# Altium schematic sheet InterfMCU.SchDoc
size 420 x 297 mm; Address1: Address1; Address2: Address2; Address3: Address3; Address4: Address4; SheetNumber: 5; SheetTotal: 5; Scale: 1:1; DocumentType: Схема электрическая принципиальная
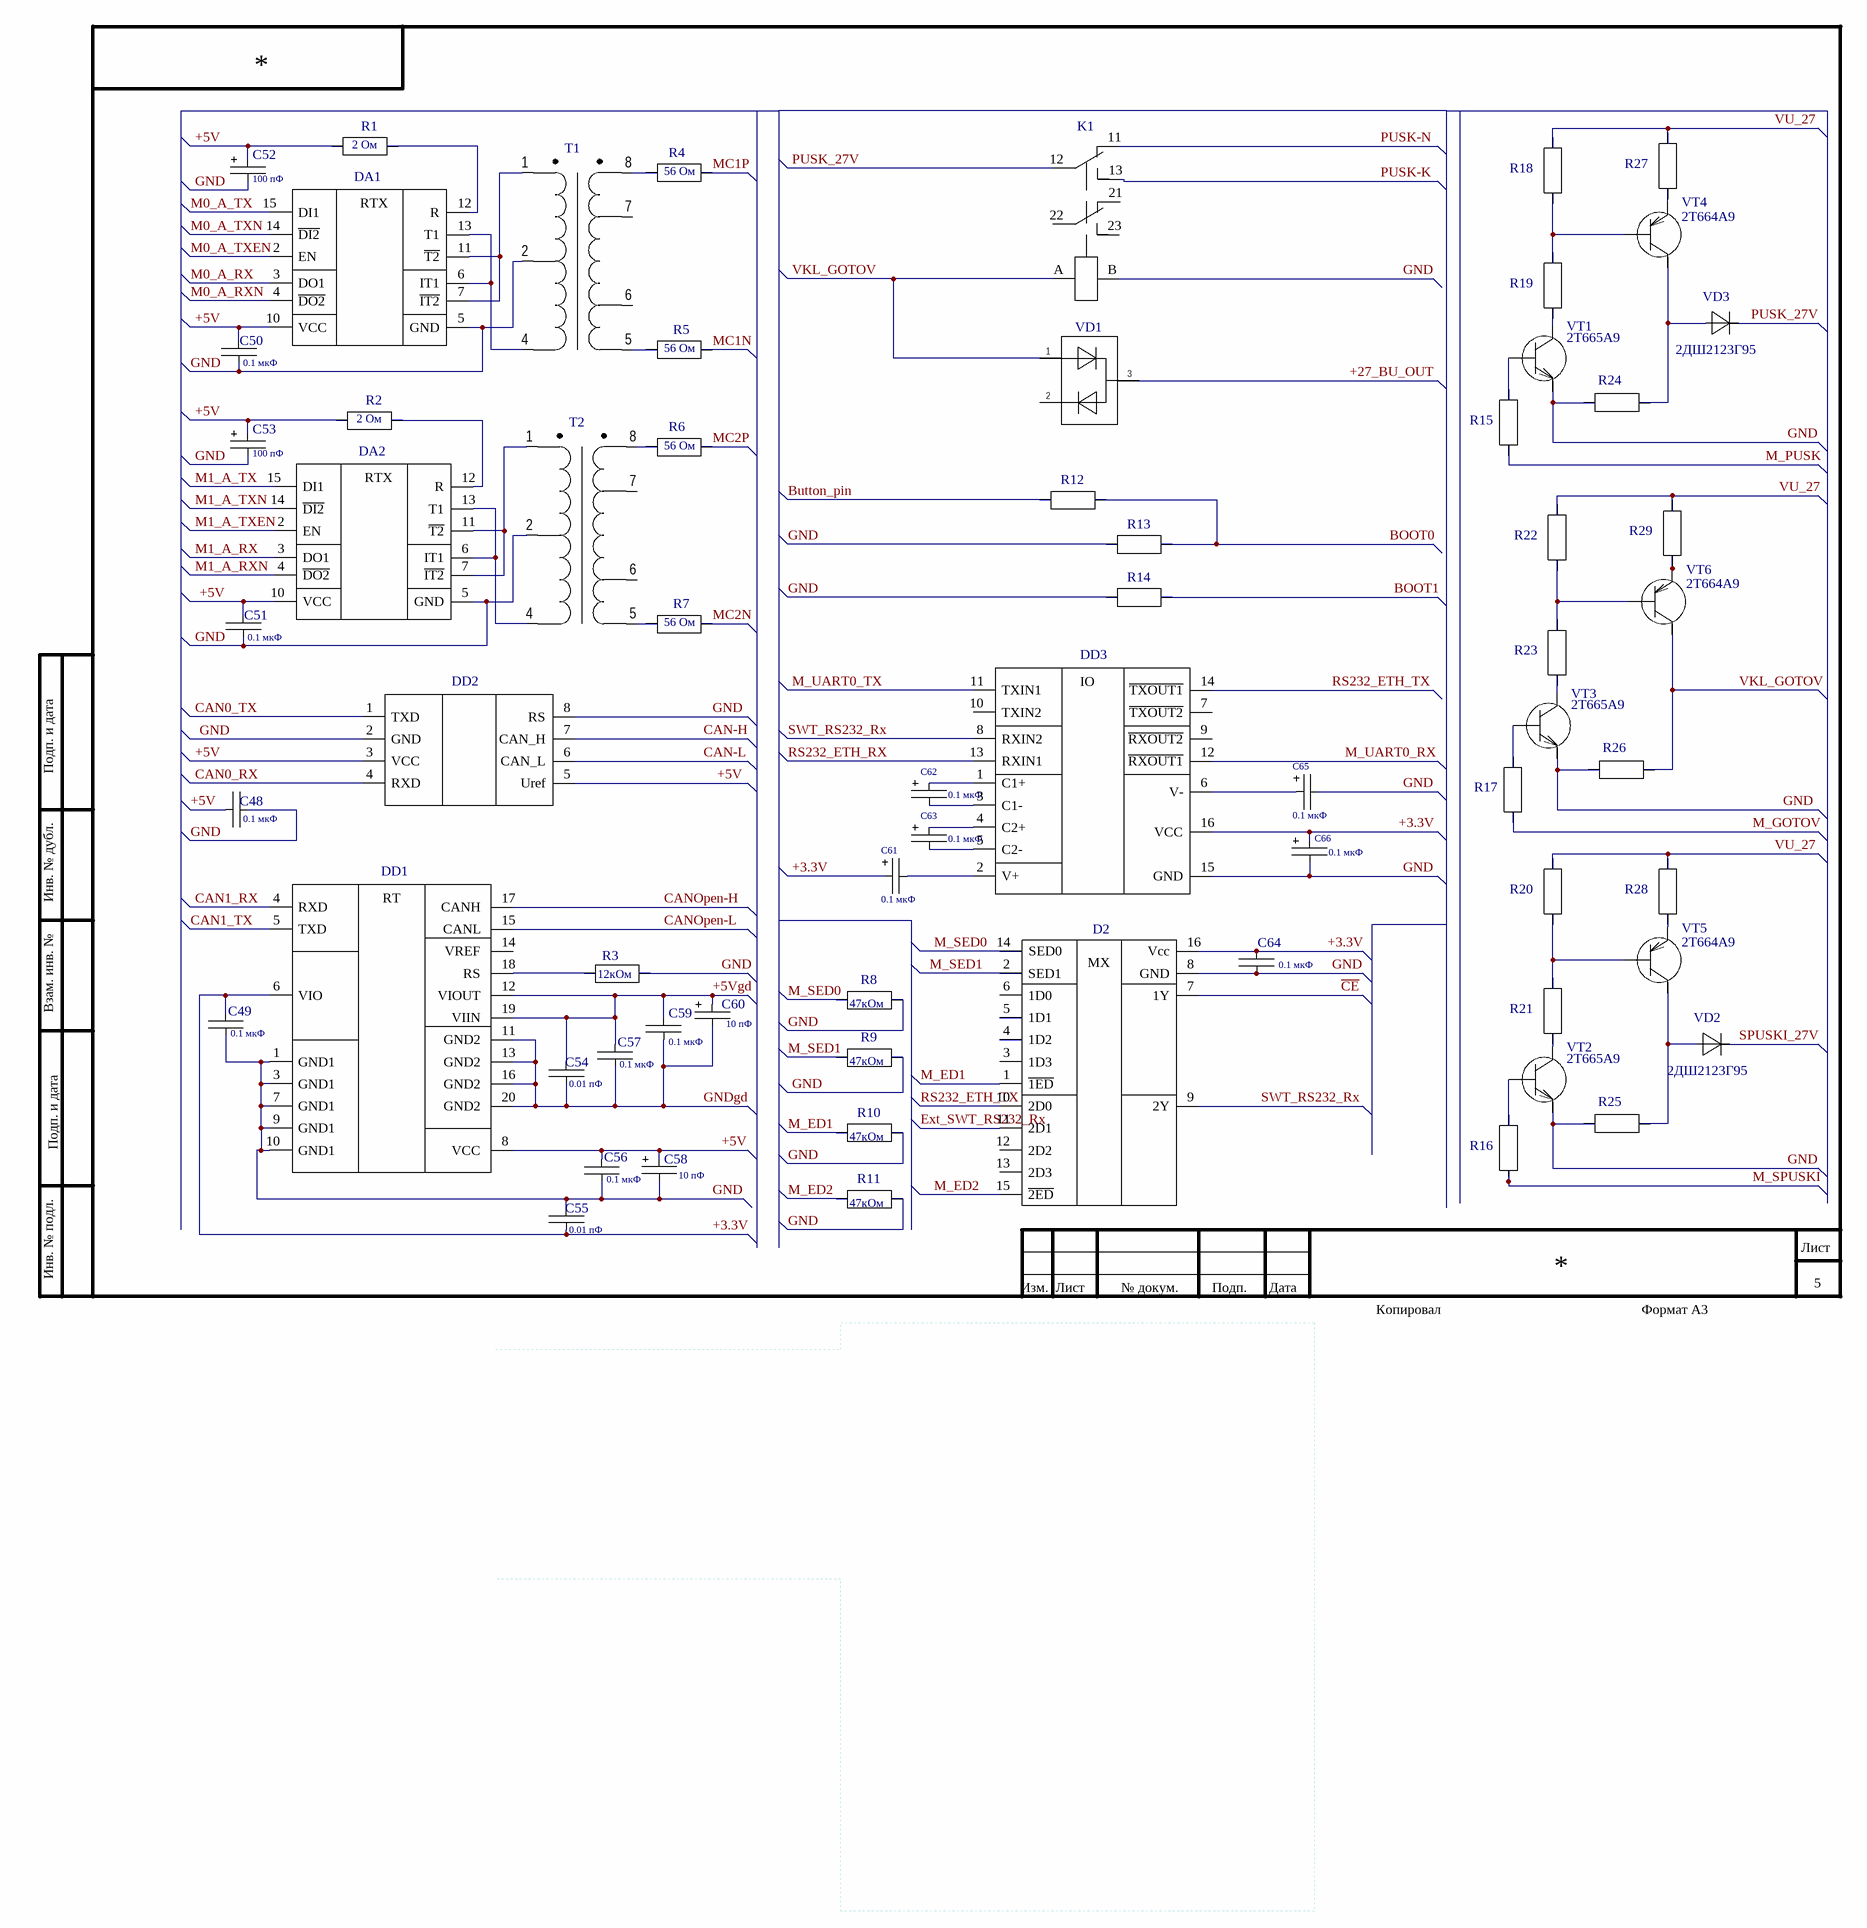
[diagram p0: InterfMCU.SchDoc]

## Parts
C48  0.1 мкФ  [C0805]
C49  0.1 мкФ  [C0805]
C50  0.1 мкФ  [C0805]
C51  0.1 мкФ  [C0805]
C52  100 пФ  [К53-68E]
C53  100 пФ  [К53-68E]
C54  0.01 пФ  [C0805]
C55  0.01 пФ  [C0805]
C56  0.1 мкФ  [C0805]
C57  0.1 мкФ  [C0805]
C58  10 пФ  [К53-67]
C59  0.1 мкФ  [C0805]
C60  10 пФ  [К53-67]
C61  0.1 мкФ  [К53-67]
C62  0.1 мкФ  [К53-67]
C63  0.1 мкФ  [К53-67]
C64  0.1 мкФ  [C0805]
C65  0.1 мкФ  [К53-67]
C66  0.1 мкФ  [К53-67]
D2  1554КП12ТБ  [1554КП12ТБ]  (value not drawn)
DA1  5559ИН13У1  [N09.28-1B]  (value not drawn)
DA2  5559ИН13У1  [N09.28-1B]  (value not drawn)
DD1  ADM3053BRWZ-REEL7_1  [SOIC-20]  (value not drawn)
DD2  ILA82C251D  [SOIC-8]  (value not drawn)
DD3  ILX3232  [SOIC-16]  (value not drawn)
K1  РЭК60  [RELE-REK61_K_RELE-REK-61(Primary)]  (value not drawn)
R1  2 Ом  [P1-12-0.5(1210)]
R2  2 Ом  [P1-12-0.5(1210)]
R3  12кОм  [P1-12-0.125(0805)]
R4  56 Ом  [P1-12-0.5(1210)]
R5  56 Ом  [P1-12-0.5(1210)]
R6  56 Ом  [P1-12-0.5(1210)]
R7  56 Ом  [P1-12-0.5(1210)]
R8  47кОм  [P1-12-0.125(0805)]
R9  47кОм  [P1-12-0.125(0805)]
R10  47кОм  [P1-12-0.125(0805)]
R11  47кОм  [P1-12-0.125(0805)]
R12  47кОм  [P1-12-0.125(0805)]  (value not drawn)
R13  47кОм  [P1-12-0.125(0805)]  (value not drawn)
R14  47кОм  [P1-12-0.125(0805)]  (value not drawn)
R15  47кОм  [P1-12-0.125(0805)]  (value not drawn)
R16  47кОм  [P1-12-0.125(0805)]  (value not drawn)
R17  47кОм  [P1-12-0.125(0805)]  (value not drawn)
R18  47кОм  [P1-12-0.125(0805)]  (value not drawn)
R19  47кОм  [P1-12-0.125(0805)]  (value not drawn)
R20  47кОм  [P1-12-0.125(0805)]  (value not drawn)
R21  47кОм  [P1-12-0.125(0805)]  (value not drawn)
R22  47кОм  [P1-12-0.125(0805)]  (value not drawn)
R23  47кОм  [P1-12-0.125(0805)]  (value not drawn)
R24  47кОм  [P1-12-0.125(0805)]  (value not drawn)
R25  47кОм  [P1-12-0.125(0805)]  (value not drawn)
R26  47кОм  [P1-12-0.125(0805)]  (value not drawn)
R27  47кОм  [P1-12-0.125(0805)]  (value not drawn)
R28  47кОм  [P1-12-0.125(0805)]  (value not drawn)
R29  47кОм  [P1-12-0.125(0805)]  (value not drawn)
VD1  2Д707АС9  [KT-46]  (value not drawn)
VD2  2ДШ2123Г95  [KT-99-1]
VD3  2ДШ2123Г95  [KT-99-1]
VT1  2T665A9  [KT-99-1]
VT2  2T665A9  [KT-99-1]
VT3  2T665A9  [KT-99-1]
VT4  2T664A9  [KT-99-1]
VT5  2T664A9  [KT-99-1]
VT6  2T664A9  [KT-99-1]
Т1  (no value)  [ТИЛ6В]
Т2  (no value)  [ТИЛ6В]

## Nets
+3.3V: C49.1 C55.2 C61.1 C64.1 C66.1 D2.16(Vcc) DD1.6(VIO) DD3.16(VCC)
+5V: C48.1 C50.1 C51.1 C52.1 C53.1 C56.1 C58.1 DA1.10(VCC) DA2.10(VCC) DD1.8(VCC) DD2.3(VCC) DD2.5(Uref) R1.1 R2.1
+5Vgd: C54.1 C57.1 C59.1 C60.1 DD1.12(VIOUT) DD1.19(VIIN)
+27_BU_OUT: VD1.3
~{CE}: D2.7(1Y)
BOOT0: R12.2 R13.2
BOOT1: R14.2
Button_pin: R12.1
CAN0_RX: DD2.4(RXD)
CAN0_TX: DD2.1(TXD)
CAN1_RX: DD1.4(RXD)
CAN1_TX: DD1.5(TXD)
CAN-H: DD2.7(CAN_H)
CAN-L: DD2.6(CAN_L)
CANOpen-H: DD1.17(CANH)
CANOpen-L: DD1.15(CANL)
Ext_SWT_RS232_Rx: D2.11(2D1)
GND: C48.2 C49.2 C50.2 C51.2 C52.2 C53.2 C55.1 C56.2 C58.2 C64.2 C65.2 C66.2 D2.8(GND) DA1.5(GND) DA2.5(GND) DD1.1(GND1) DD1.3(GND1) DD1.7(GND1) DD1.9(GND1) DD1.10(GND1) DD2.2(GND) DD2.8(RS) DD3.15(GND) K1.B R3.2 R8.2 R9.2 R10.2 R11.2 R13.1 R14.1 R24.2 R25.2 R26.2 VT1.1 VT2.1 VT3.1 Т1.2 Т2.2
GNDgd: C54.2 C57.2 C59.2 C60.2 DD1.11(GND2) DD1.13(GND2) DD1.16(GND2) DD1.20(GND2)
M0_A_RX: DA1.3(DO1)
M0_A_RXN: DA1.4(~{DO2})
M0_A_TX: DA1.15(DI1)
M0_A_TXEN: DA1.2(EN)
M0_A_TXN: DA1.14(~{DI2})
M1_A_RX: DA2.3(DO1)
M1_A_RXN: DA2.4(~{DO2})
M1_A_TX: DA2.15(DI1)
M1_A_TXEN: DA2.2(EN)
M1_A_TXN: DA2.14(~{DI2})
M_ED1: D2.1(~{1ED}) R10.1
M_ED2: D2.15(~{2ED}) R11.1
M_GOTOV: R17.1
M_PUSK: R15.1
M_SED0: D2.14(SED0) R8.1
M_SED1: D2.2(SED1) R9.1
M_SPUSKI: R16.1
M_UART0_RX: DD3.12(~{RXOUT1})
M_UART0_TX: DD3.11(TXIN1)
MC1N: R5.2
MC1P: R4.2
MC2N: R7.2
MC2P: R6.2
PUSK-K: K1.13
PUSK-N: K1.11
PUSK_27V: K1.12 VD3.3
RS232_ETH_RX: DD3.13(RXIN1)
RS232_ETH_TX: D2.10(2D0) DD3.14(~{TXOUT1})
SPUSKI_27V: VD2.3
SWT_RS232_Rx: D2.9(2Y) DD3.8(RXIN2)
VKL_GOTOV: K1.A R26.1 VD1.1 VT6.2
VU_27: R18.2 R20.2 R22.2 R27.2 R28.2 R29.2
NetC61_2: C61.2 DD3.2(V+)
NetC62_1: C62.1 DD3.1(С1+)
NetC62_2: C62.2 DD3.3(С1-)
NetC63_1: C63.1 DD3.4(C2+)
NetC63_2: C63.2 DD3.5(C2-)
NetC65_1: C65.1 DD3.6(V-)
NetDA1_6: DA1.6(IT1) DA1.13(T1) Т1.4
NetDA1_7: DA1.7(~{IT2}) DA1.11(~{T2}) Т1.1
NetDA1_12: DA1.12(R) R1.2
NetDA2_6: DA2.6(IT1) DA2.13(T1) Т2.4
NetDA2_7: DA2.7(~{IT2}) DA2.11(~{T2}) Т2.1
NetDA2_12: DA2.12(R) R2.2
NetDD1_18: DD1.18(RS) R3.1
NetR4_1: R4.1 Т1.8
NetR5_1: R5.1 Т1.5
NetR6_1: R6.1 Т2.8
NetR7_1: R7.1 Т2.5
NetR15_2: R15.2 VT1.3
NetR16_2: R16.2 VT2.3
NetR17_2: R17.2 VT3.3
NetR18_1: R18.1 R19.2 VT4.3
NetR19_1: R19.1 VT1.2
NetR20_1: R20.1 R21.2 VT5.3
NetR21_1: R21.1 VT2.2
NetR22_1: R22.1 R23.2 VT6.3
NetR23_1: R23.1 VT3.2
NetR24_1: R24.1 VD3.2 VT4.2
NetR25_1: R25.1 VD2.2 VT5.2
NetR27_1: R27.1 VT4.1
NetR28_1: R28.1 VT5.1
NetR29_1: R29.1 VT6.1

Not connected (* = marked no-connect by the designer): D2 3(1D3) 4(1D2) 5(1D1) 6(1D0) 12(2D2) 13(2D3); DD1 14(VREF_); DD3 7(~{TXOUT2}) 9(~{RXOUT2}) 10(TXIN2); K1 21 22 23; VD1 2; Т1 6 7; Т2 6 7

## Notes on the sheet
- Подп. и дата
- Инв. № дубл.
- Взам. инв. №
- Инв. № подл.
- Изм.
- Лист
- № докум.
- Подп.
- Дата
- Копировал
- Формат А3
- (in symbol 1554КП12ТБ) MX
- (in symbol 5559ИН13У1) RTX
- (in symbol ADM3053BRWZ-REEL7_1) RT
- (in symbol ILX3232) IO

## Library data of the parts
C48 C50 C51 C64 = К10-69_0.1mk: Керамический чип-конденсатор серии К10-79; PartNumber: К10-69в-*-* В- * ± *% *; TypePrefix: C; TU: АЖЯР.673511.002ТУ; TUHolder: ОАО НИИ "ГИРИКОНД"; Value: *; PackegeType: *
C49 C56 C57 C59 = К10-69_0.1mk: Керамический чип-конденсатор серии К10-69; PartNumber: К10-69в-*-* В- * ± *% *; TypePrefix: C; TU: АЖЯР.673511.002ТУ; TUHolder: ОАО НИИ "ГИРИКОНД"; Value: *; PackegeType: *
C52 C53 = К53-68E: Конденсатор полярный
C54 C55 = К10-69_0.01p: Керамический чип-конденсатор серии К10-79; PartNumber: К10-69в-*-* В- * ± *% *; TypePrefix: C; TU: АЖЯР.673511.002ТУ; TUHolder: ОАО НИИ "ГИРИКОНД"; Value: *; PackegeType: *
C58 C60 = К53-68B: Конденсатор / полярный
C61-C63 C65 C66 = К53-68B_0.1mk: Конденсатор / полярный; PartNumber: К53-68 "C" - 25В - 4.7мкФ ±10%; Value: 4.7мкФ; TU: АЖЯР.673546.007; TUHolder: ОАО "Элеконд", Россия, г.Сарапул; Prefix: C; TypePrefix: Конденсатор; TypeName: *
D2 = 1554КП12ТБ: Два селектор-мультиплексора 4-1; TU: АЕЯР.431200.182-15ТУ; TUHolder: "Интеграл"; TypePrefix: D; PackegeType: 402.16-32; PartNumber: 1554КП12ТБ
DA1 DA2 = 5559ИН13У1: МКИО приемопередатчик 5559ИН13Т; TypePrefix: Приемопердатчик МКИО; TU: АЕЯР.431230.591ТУ; TUHolder: ОАО НПО "Физика",Россия, г. Москва; Prefix: DA; TipeName: Приемопередатчики; Value: *; PartNumber: 5559ИН13У1
DD1 = ADM3053BRWZ-REEL7_1: Микросборка CAN с гальванической развязкой; TypePrefix: Приемопередатчик; TUHolder: Analog Devices, США; Prefix: DD; TypeName: Приемопередатчики; Value: *; PartNumber: ADM3053BRWZ-REEL7_1; TU: *
DD2 = ILA82C251D: CAN Приемопередатчик  ILA82C251D; TypePrefix: Приемопередатик CAN; TUHolder: ОАО "ИНТЕГРАЛ", Республика Беларусь, г.Минск; Prefix: DD; TipeName: Приемопередатчики; Value: *; PartNumber: ILA82C251D; TU: *
DD3 = ILX3232: RS-232 Приемопередатчик ILX3232; TypePrefix: Приемопередатчик RS-232; TUHolder: ОАО "ИНТЕГРАЛ", Республика Беларусь, г.Минск; Prefix: DD; TypeName: Приемопередатчики; Value: *; PartNumber: ILX3232; TU: *
K1 = РЭК60: Value: Реле РЭК61В РВИМ.647611.008-18; TU: РВИМ.647611.008ТУ
R1 R2 = Р1-12-0,5: Резистор постоянный
R3 = Р1-12-0,125: Резистор постоянный
R4-R7 = Р1-12-0,5_56: Резистор постоянный
R8-R29 = Р1-12_47k: Постоянные непроволочные безвыводные резисторы общего применения Р1-12; PartNumber: Р1-12-*-*±*%-*; TU: АЛЯР.434110.005 ТУ; TUHolder: ЗАО "РЕОМ"; TypePrefix: R; PackegeType: *; Value: *
VD1 = 2Д707АС9: 2Д707АС9 диод импульсный; TU: аА0.339.583ТУ; TUHolder: ООО "НПК ДАЛЕКС"; TypePrefix: VD; Value: *; PartNumber: 2Д707АС9
VD2 VD3 = 2ДШ2123Г95: Диод Шоттки; TU: АЕЯР.432120.567ТУ; PackegeType: КТ-99-1; TUHolder: ОА ВЗПП-С; TypePrefix: VD; Value: *; PartNumber: 2ДШ2123Г95
VT1-VT3 = 2T665A9: npn кремниевый транзистор; PackegeType: КТ-47; TU: аА0.339.559ТУ; TUHolder: ЗАО "Группа Кремний Эл"; TypePrefix: Транзистор; PartNumber: 2T665A9
VT4-VT6 = 2T664A9: pnp кремниевый транзистор; PackegeType: КТ-47; TU: аА0.339.559ТУ; TUHolder: ЗАО "Группа Кремний Эл"; TypePrefix: Транзистор; PartNumber: 2T664A9
Т1 Т2 = ТИЛ6В: Трансформатор для ГОСТ Р 52070-2003